# EAGLE design Attiny_pjon_sensor_corriente_ICSP (EAGLE 7.3.0)
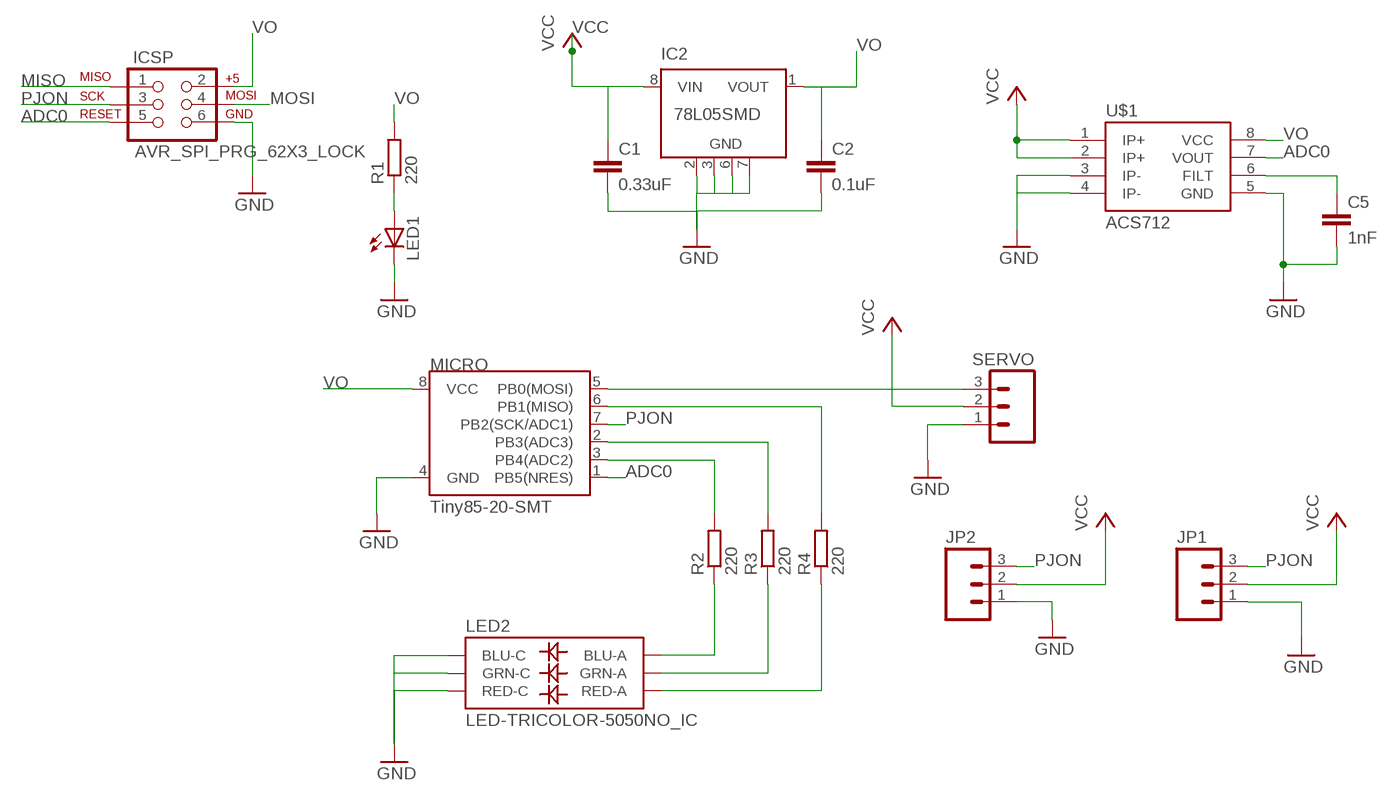
[diagram p0: schematic, sheet 1]

## Parts
C1  0.33uF  C-EUC1206  [C1206]
C2  0.1uF  C-EUC1206  [C1206]
C5  1nF  C-EUC1206  [C1206]
IC2  78L05SMD  [SO08]
ICSP  AVR_SPI_PRG_62X3_LOCK  [2X3_LOCK]
JP1  M03PTH  [1X03]
JP2  M03PTH  [1X03]
LED1  LEDSMT1206  [1206]
LED2  LED-TRICOLOR-5050NO_IC  [LED-TRICOLOR-5050]
MICRO  Tiny85-20-SMT  ATTINY45TINY85-20-SMT  [SO08-EIAJ]
R1  220  R-EU_R1206  [R1206]
R2  220  R-EU_R1206  [R1206]
R3  220  R-EU_R1206  [R1206]
R4  220  R-EU_R1206  [R1206]
SERVO  M03PTH  [1X03]
U$1  ACS712  [SO08]

## Nets
ADC0: ICSP.5 MICRO.1(PB5(NRES)) U$1.7(VOUT)
GND: C1.2 C2.2 C5.2 IC2.2(GND) IC2.3(GND) IC2.6(GND) IC2.7(GND) ICSP.6 JP1.1 JP2.1 LED1.C LED2.4(BLU-C) LED2.5(RED-C) LED2.6(GRN-C) MICRO.4(GND) SERVO.1 U$1.3(IP-) U$1.4(IP-) U$1.5(GND)
MISO: ICSP.1 MICRO.6(PB1(MISO)) R4.2
MOSI: ICSP.4 MICRO.5(PB0(MOSI)) SERVO.3
N$1: MICRO.3(PB4(ADC2)) R2.2
N$2: C5.1 U$1.6(FILT)
N$3: MICRO.2(PB3(ADC3)) R3.2
N$4: LED2.3(BLU-A) R2.1
N$5: LED2.1(GRN-A) R3.1
N$7: LED2.2(RED-A) R4.1
N$8: LED1.A R1.1
PJON: ICSP.3 JP1.3 JP2.3 MICRO.7(PB2(SCK/ADC1))
VCC: C1.1 IC2.8(VIN) JP1.2 JP2.2 SERVO.2 U$1.1(IP+) U$1.2(IP+)
VO: C2.1 IC2.1(VOUT) ICSP.2 MICRO.8(VCC) R1.2 U$1.8(VCC)
Unconnected: IC2.4(NC) IC2.5(NC)

## Library data of the parts
C1 C2 C5 = rcl:C-EU: CAPACITOR, European symbol
IC2 = linear:78L*SMD: Positive VOLTAGE REGULATOR
ICSP = SparkFun-Connectors:AVR_SPI_PRG_6: AVR ISP 6 Pin This is the reduced ISP connector for AVR programming. Common on Arduino. This footprint will take up less PCB space and can be used with a 10-pin to 6-pin adapter such as SKU: BOB-08508 **Special note about "TEST_POINT" package. The stop mask is on the top side, so if you want your programming test points to be on the bottom of your board, make sure to place this package on the bottom side of the board. This also ensure that the orientation to program from the bottom side will be correct.
JP1 JP2 SERVO = SparkFun-Connectors:M03: Header 3 Standard 3-pin 0.1" header. Use with straight break away headers (SKU : PRT-00116), right angle break away headers (PRT-00553), swiss pins (PRT-00743), machine pins (PRT-00117), and female headers (PRT-00115). Molex polarized connector foot print use with SKU : PRT-08232 with associated crimp pins and housings.
LED1 = led:LED: LED OSRAM: - CHIPLED LG R971, LG N971, LY N971, LG Q971, LY Q971, LO R971, LY R971 LH N974, LH R974 LS Q976, LO Q976, LY Q976 LO Q996 - Hyper CHIPLED LW Q18S LB Q993, LB Q99A, LB R99A - SideLED LS A670, LO A670, LY A670, LG A670, LP A670 LB A673, LV A673, LT A673, LW A673 LH A674 LY A675 LS A676, LA A676, LO A676, LY A676, LW A676 LS A679, LY A679, LG A679 - Hyper Micro SIDELED® LS Y876, LA Y876, LO Y876, LY Y876 LT Y87S - SmartLED LW L88C, LW L88S LB L89C, LB L89S, LG L890 LS L89K, LO L89K, LY L89K LS L896, LA L896, LO L896, LY L896 - TOPLED LS T670, LO T670, LY T670, LG T670, LP T670 LSG T670, LSP T670, LSY T670, LOP T670, LYG T670 LG T671, LOG T671, LSG T671 LB T673, LV T673, LT T673, LW T673 LH T674 LS T676, LA T676, LO T676, LY T676, LB T676, LH T676, LSB T676, LW T676 LB T67C, LV T67C, LT T67C, LS T67K, LO T67K, LY T67K, LW E67C LS E67B, LA E67B, LO E67B, LY E67B, LB E67C, LV E67C, LT E67C LW T67C LS T679, LY T679, LG T679 LS T770, LO T770, LY T770, LG T770, LP T770 LB T773, LV T773, LT T773, LW T773 LH T774 LS E675, LA E675, LY E675, LS T675 LS T776, LA T776, LO T776, LY T776, LB T776 LHGB T686 LT T68C, LB T68C - Hyper Mini TOPLED® LB M676 - Mini TOPLED Santana® LG M470 LS M47K, LO M47K, LY M47K Source: http://www.osram.convergy.de LUXEON: - LUMILED® LXK2-PW12-R00, LXK2-PW12-S00, LXK2-PW14-U00, LXK2-PW14-V00 LXK2-PM12-R00, LXK2-PM12-S00, LXK2-PM14-U00 LXK2-PE12-Q00, LXK2-PE12-R00, LXK2-PE12-S00, LXK2-PE14-T00, LXK2-PE14-U00 LXK2-PB12-K00, LXK2-PB12-L00, LXK2-PB12-M00, LXK2-PB14-N00, LXK2-PB14-P00, LXK2-PB14-Q00 LXK2-PR12-L00, LXK2-PR12-M00, LXK2-PR14-Q00, LXK2-PR14-R00 LXK2-PD12-Q00, LXK2-PD12-R00, LXK2-PD12-S00 LXK2-PH12-R00, LXK2-PH12-S00 LXK2-PL12-P00, LXK2-PL12-Q00, LXK2-PL12-R00 Source: www.luxeon.com KINGBRIGHT: KA-3528ASYC Source: www.kingbright.com
LED2 = SparkFun-LED:LED-TRICOLOR-5050
MICRO = SparkFun-DigitalIC:ATTINY45: Atmel 8-pin 2/4/8kB flash uC; PROD_ID: IC-09092
R1-R4 = resistor:R-EU_: RESISTOR, European symbol
U$1 = SparkFun-AnalogIC:ACS712: Hall-effect-based isolated linear current sensor; PROD_ID: IC-08964

## Board
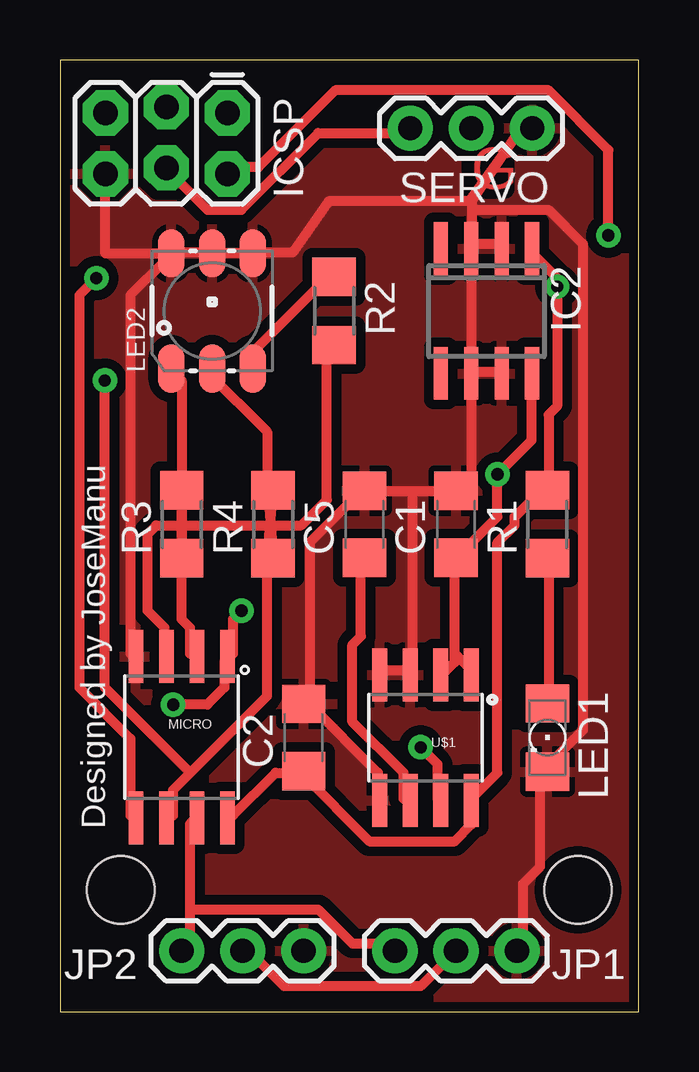
[diagram p1: board, top side]
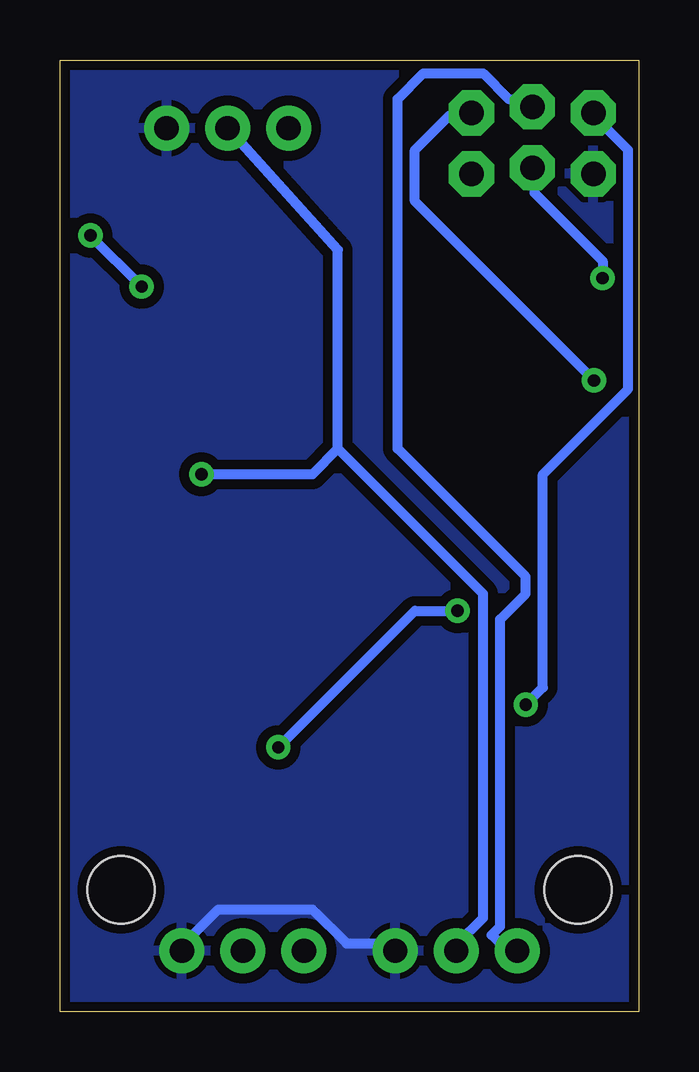
[diagram p2: board, bottom side, seen from below]

Size 24.12 x 39.67 mm. Coordinates in mm from the lower left corner, seen from the top.
Outline: 24.12,0 24.12,39.67 0,39.67 0,0 24.12,0
Copper layers (1*16): Top 0.035mm / dielectric 1.5mm / Bottom 0.035mm
Design rules "SparkFun *": minimum track width 16mil, minimum drill 20mil, track to track 12mil, track to pad 12mil, pad to pad 12mil, via to via 12mil, smd to smd 12mil, copper to edge 8mil, drill to drill 8mil, minimum pad ring 12mil, minimum via ring 10mil, stop-mask expansion 4mil, vias tented up to drill 20mil, thermal gap 10mil
Holes 2.8 mm at 2.53,5.08 21.58,5.08

### Footprints (pad centres in the part's own frame; a part is rotated, then mirrored left to right if it is on the bottom)
C1206 = smd 1.6 x 1.8: 1 -1.4,0; 2 1.4,0
SO08 = smd 0.6 x 2.2: 1 -1.905,-2.6; 2 -0.635,-2.6; 3 0.635,-2.6; 4 1.905,-2.6; 5 1.905,2.6; 6 0.635,2.6; 7 -0.635,2.6; 8 -1.905,2.6
2X3_LOCK = drill 1.016 pad 1.88 octagon: 1 0,0; 2 0,2.54; 3 2.54,-0.254; 4 2.54,2.286; 5 5.08,0; 6 5.08,2.54
1X03 = drill 1.016 pad 1.88: 1 0,0; 2 2.54,0; 3 5.08,0
1206 = smd 1.6 x 1.803: A -1.422,0; C 1.422,0
LED-TRICOLOR-5050 = smd 2 x 1.1: 1 -2.4,1.7; 2 -2.4,0; 3 -2.4,-1.7; 4 2.4,-1.7; 5 2.4,0; 6 2.4,1.7
SO08-EIAJ = smd 0.61 x 2.21: 1 -1.905,-3.378; 2 -0.635,-3.378; 3 0.635,-3.378; 4 1.905,-3.378; 5 1.905,3.353; 6 0.635,3.353; 7 -0.635,3.353; 8 -1.905,3.353
R1206 = smd 1.6 x 1.803: 1 -1.422,0; 2 1.422,0
SO08' = smd 0.61 x 2.21: 1 -1.905,-2.616; 2 -0.635,-2.616; 3 0.635,-2.616; 4 1.905,-2.616; 5 1.905,2.616; 6 0.635,2.616; 7 -0.635,2.616; 8 -1.905,2.616

### Placement (x,y rotation side)
C1  16.5,20.32 90 top
C2  10.15,11.43 90 top
C5  12.69,20.32 90 top
IC2  17.77,29.21 180 top
ICSP  6.97,37.47 180 top
JP1  19.04,2.54 180 top
JP2  10.15,2.54 180 top
LED1  20.31,11.43 270 top
LED2  6.34,29.21 90 top
MICRO  5.07,11.43 180 top
R1  20.31,20.32 90 top
R2  11.42,29.21 270 top
R3  5.07,20.32 90 top
R4  8.88,20.32 90 top
SERVO  19.67,36.83 180 top
U$1  ACS712  [SO08']  15.23,11.43 180 top

### Tracks (layer width: path | path; a pad name or v marks a point on that pad's centre or on a via)
ADC0  (via drill 0.51)
  Top 0.406: v7.56,16.71 7.2,16.36 7.2,14.93 MICRO.1 6.85,14.58 6.85,13.51 6.14,12.8 v4.71,12.8 | v15.03,11.02 15.74,10.31 15.74,8.89 U$1.7
  Bottom 0.406: v7.56,16.71 9.34,16.71 v15.03,11.02 | v4.71,12.8 4,13.51 4,22.4 0.45,25.96 0.45,35.92 1.87,37.34 ICSP.5
GND
  Top 0.406: LED2.6 4.71,31.65 6.14,31.65 LED2.5 6.49,31.65 7.91,31.65 LED2.4 8.27,31.65 9.69,31.65 11.19,33.78 17.06,33.78 19.24,36.83 SERVO.1 19.19,36.83 17.16,33.78 17.16,33.43 | MICRO.4 2.94,14.93 2.94,29.87 4.36,31.29 LED2.6 | JP1.1 19.29,2.84 19.29,5.33 20,6.04 20,9.96 LED1.C 20.36,10.31 21.78,11.73 21.78,32 20.36,33.43 17.16,33.43 | 17.16,32 18.23,32 IC2.2 | 17.16,33.43 17.16,32 | 17.16,32 IC2.3 17.16,31.65 17.16,26.67 | U$1.5 13.25,8.89 13.25,9.96 10.4,12.8 C2.2 10.4,13.16 10.4,19.56 12.54,21.69 C5.2 12.89,21.69 14.67,21.69 | U$1.4 13.6,14.22 14.32,14.22 U$1.3 14.67,14.22 14.67,21.69 | 17.16,26.67 18.23,26.67 IC2.7 | 14.67,21.69 16.45,21.69 C1.2 16.8,22.05 17.16,22.4 17.16,26.31 IC2.6 17.16,26.67 | LED2.6 1.89,31.61 ICSP.6
  Bottom 0.406: JP2.1 10.4,2.84 12.18,2.84 13.6,4.27 17.52,4.27 18.94,2.84 JP1.1
  pour Bottom (isolate 0.406): -0.01,0 -0.01,39.37 24.12,39.37 24.12,0
  pour Top (isolate 0.406): -0.01,0 -0.01,39.37 24.12,39.37 24.12,0
MISO  (via drill 0.51)
  Top 0.406: 5.43,9.96 4.71,9.25 4.71,8.18 MICRO.6 | 5.43,9.96 8.63,13.16 8.63,18.85 R4.2 | v1.87,26.31 1.87,13.51 5.43,9.96
  Bottom 0.406: v1.87,26.31 9.34,33.78 9.34,35.92 7.91,37.34 7.2,37.34 ICSP.1
MOSI  (via drill 0.51)
  Top 0.406: v1.51,30.58 0.8,29.87 0.8,13.51 2.94,11.38 2.94,8.18 MICRO.5 | SERVO.3 14.32,36.63 10.76,36.63 7.56,33.43 6.14,33.43 4.71,34.85 ICSP.4
  Bottom 0.406: v1.51,30.58 1.51,31.29 4.36,34.14 4.36,34.85 ICSP.4
N$1
  Top 0.406: R2.2 11.12,27.74 11.12,21.34 10.05,20.27 4,20.27 3.65,19.91 3.65,16.71 4.36,16 4.36,14.93 MICRO.3
N$2
  Top 0.406: C5.1 12.54,18.85 12.54,15.65 12.18,15.29 12.18,12.09 14.32,9.96 14.32,8.89 U$1.6
N$3
  Top 0.406: R3.2 5.07,16.36 5.43,16 5.43,14.93 MICRO.2
N$4
  Top 0.406: R2.1 11.12,30.58 8.27,27.74 8.27,27.03 LED2.3
N$5
  Top 0.406: R3.1 5.07,26.31 4.71,26.67 LED2.1
N$7
  Top 0.406: R4.1 8.63,22.05 8.63,24.18 6.14,26.67 LED2.2
N$8
  Top 0.406: LED1.A 20.36,13.16 20.36,18.85 R1.1
PJON
  Top 0.406: 5.43,4.27 5.43,3.2 5.07,2.84 JP2.3 | 5.43,4.27 5.43,7.82 MICRO.7 | 5.43,4.27 10.76,4.27 12.18,2.84 13.96,2.84 JP1.3
  Bottom 0.406: ICSP.3 4.71,38.05 5.43,38.05 6.49,39.12 8.98,39.12 10.05,38.05 10.05,23.47 4.71,18.14 4.71,17.42 5.78,16.36 5.78,3.56 6.14,3.2 5.78,2.84 5.07,2.84 JP2.3
VCC  (via drill 0.51)
  Top 0.406: 16.45,14.93 16.45,14.58 16.09,14.22 U$1.2 | 16.45,14.93 16.45,18.85 C1.1 16.8,19.2 18.23,20.62 v18.23,22.4 19.65,23.82 19.65,26.31 IC2.8 | 16.45,14.93 17.16,14.22 U$1.1 | JP1.2 15.03,1.07 9.34,1.07 7.91,2.49 JP2.2
  Bottom 0.406: 12.54,23.47 12.54,31.75 SERVO.2 | 12.54,23.47 6.49,17.42 6.49,3.91 7.56,2.84 JP2.2 | v18.23,22.4 13.6,22.4 12.54,23.47
VO  (via drill 0.51)
  Top 0.406: IC2.1 19.65,31.65 20.72,30.58 v20.72,30.23 20.72,25.25 20.36,24.89 20.36,22.05 R1.2 20,21.69 18.94,20.62 18.94,20.27 18.23,19.56 18.23,9.96 17.16,8.89 U$1.8 17.16,8.53 17.16,7.82 16.45,7.11 12.89,7.11 10.05,9.96 | 10.05,9.96 8.98,9.96 7.2,8.18 MICRO.8 | 10.05,9.96 C2.1 | v22.85,32.36 22.85,35.92 20.36,38.41 11.47,38.41 8.27,35.2 7.2,35.2 ICSP.2
  Bottom 0.406: v20.72,30.23 v22.85,32.36

### Text on the board
Top: G | G
tNames: Designed by JoseManu
200bmp: S | G | S | Vcc | G | S | Vcc | G